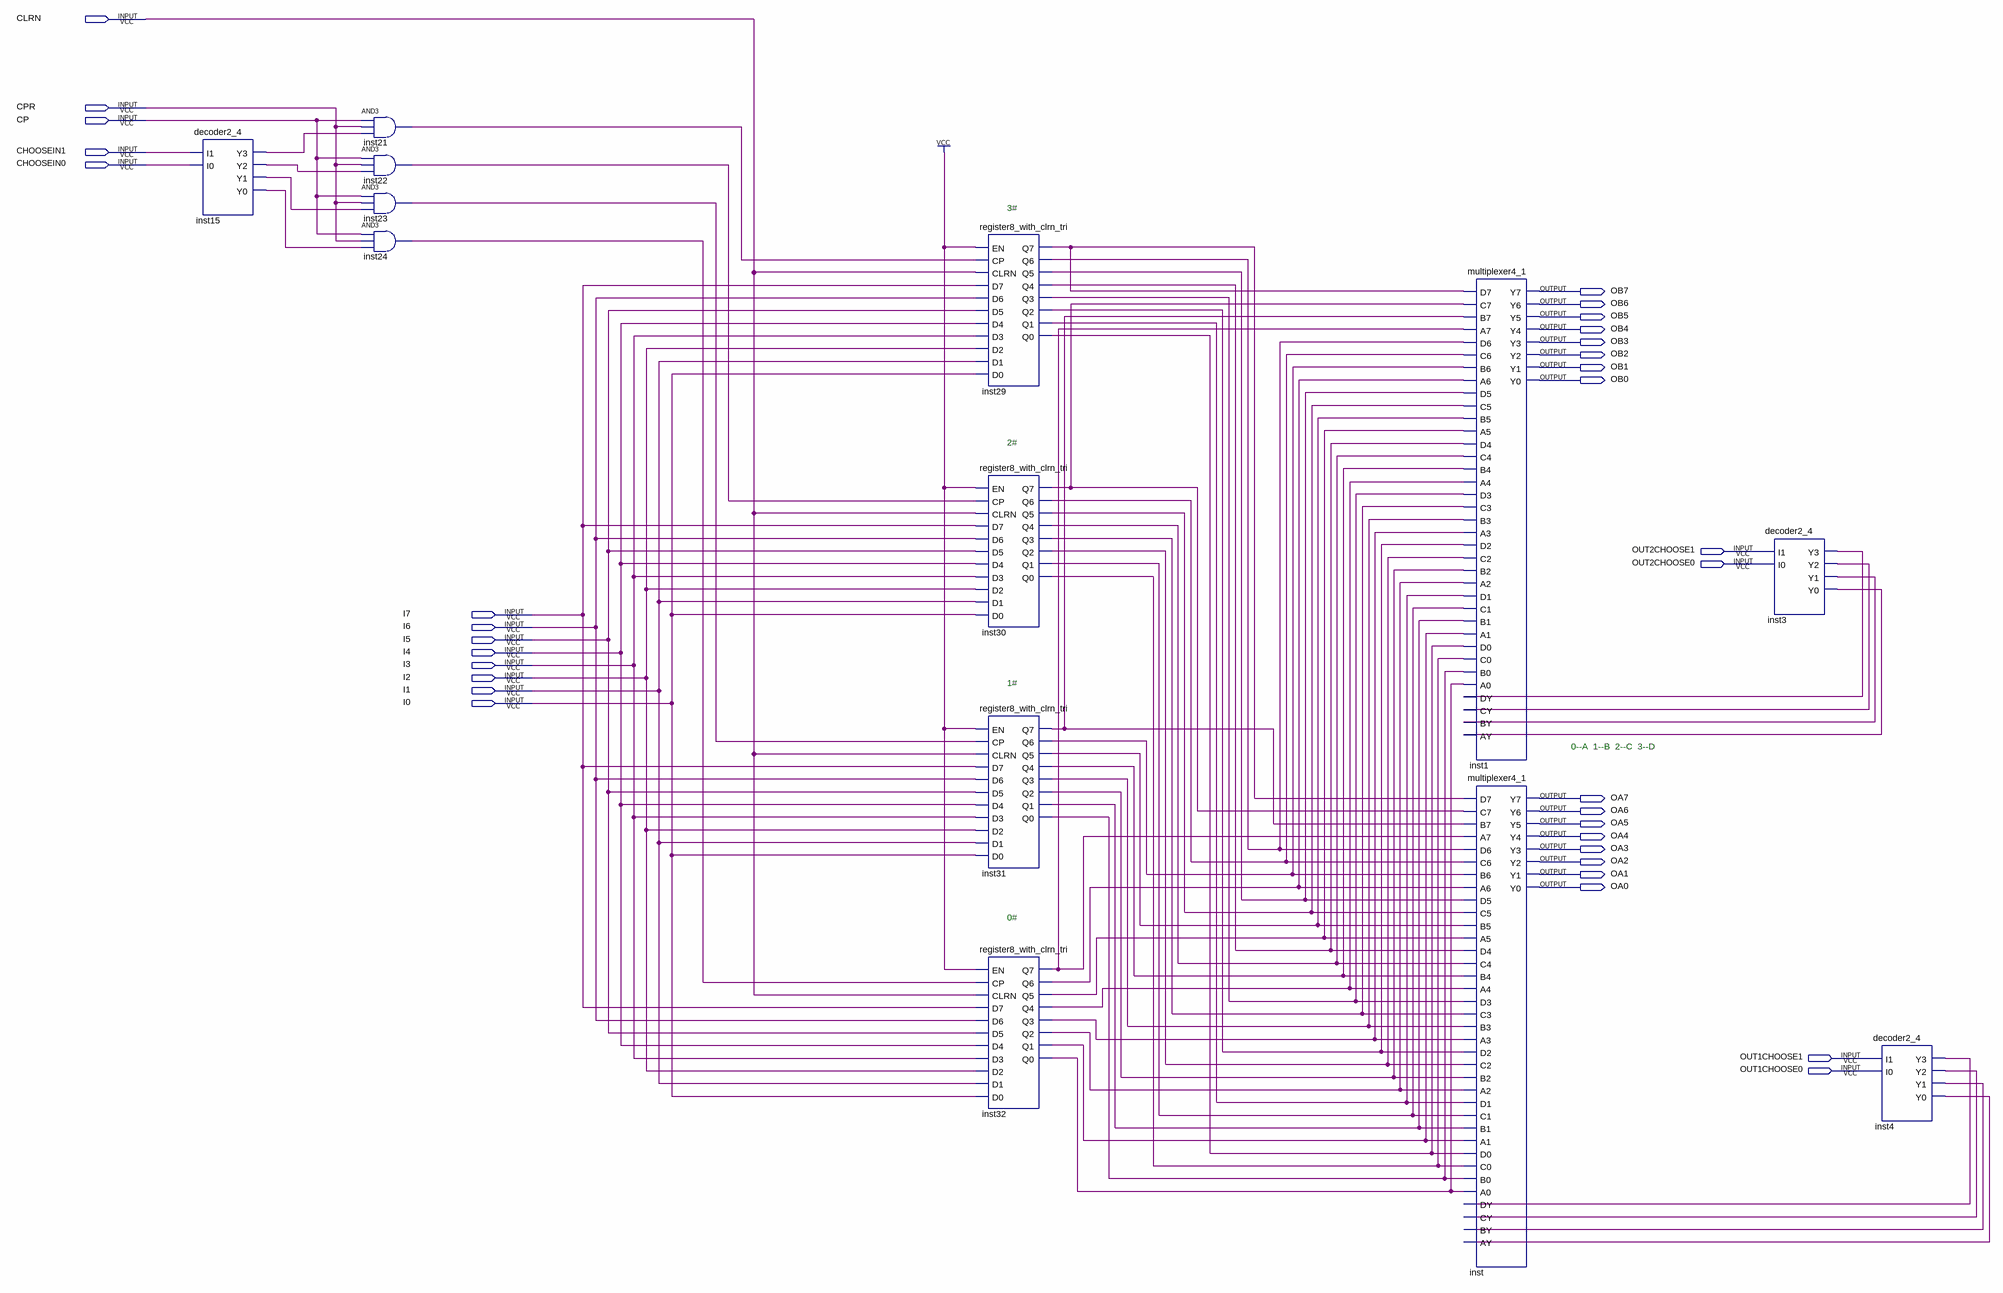
[diagram p0: schematic sheet]
// Quartus schematic register8_group4.bdf as structural Verilog: 13 symbols, 33 pins
module register8_group4 (
  input  CLRN,
  input  CPR,
  input  CP,
  input  CHOOSEIN1,
  input  CHOOSEIN0,
  input  OUT2CHOOSE1,
  input  OUT2CHOOSE0,
  input  I7,
  input  I6,
  input  I5,
  input  I4,
  input  I3,
  input  I2,
  input  I1,
  input  I0,
  input  OUT1CHOOSE1,
  input  OUT1CHOOSE0,
  output OB7,
  output OB6,
  output OB5,
  output OB4,
  output OB3,
  output OB2,
  output OB1,
  output OB0,
  output OA7,
  output OA6,
  output OA5,
  output OA4,
  output OA3,
  output OA2,
  output OA1,
  output OA0
);

  wire inst3_y0, inst3_y1, inst3_y2, inst3_y3, inst4_y0, inst4_y1, inst4_y2, inst4_y3, inst15_y0, inst15_y1,
       inst15_y2, inst15_y3, inst21_out, inst22_out, inst23_out, inst24_out, inst29_q0, inst29_q1, inst29_q2,
       inst29_q3, inst29_q4, inst29_q5, inst29_q6, inst29_q7, inst30_q0, inst30_q1, inst30_q2, inst30_q3,
       inst30_q4, inst30_q5, inst30_q6, inst30_q7, inst31_q0, inst31_q1, inst31_q2, inst31_q3, inst31_q4,
       inst31_q5, inst31_q6, inst31_q7, inst32_q0, inst32_q1, inst32_q2, inst32_q3, inst32_q4, inst32_q5,
       inst32_q6, inst32_q7;

  decoder2_4 inst15 (.I1(CHOOSEIN1), .I0(CHOOSEIN0), .Y3(inst15_y3), .Y2(inst15_y2), .Y1(inst15_y1), .Y0(inst15_y0));
  and inst21 (inst21_out, CP, CPR, inst15_y3);
  and inst22 (inst22_out, CP, CPR, inst15_y2);
  and inst23 (inst23_out, CP, CPR, inst15_y1);
  and inst24 (inst24_out, CP, CPR, inst15_y0);
  register8_with_clrn_tri inst29 (
    .EN(1'b1), .CP(inst21_out), .CLRN(CLRN), .D7(I7), .D6(I6), .D5(I5), .D4(I4), .D3(I3), .D2(I2), .D1(I1),
    .D0(I0), .Q7(inst29_q7), .Q6(inst29_q6), .Q5(inst29_q5), .Q4(inst29_q4), .Q3(inst29_q3), .Q2(inst29_q2),
    .Q1(inst29_q1), .Q0(inst29_q0));
  register8_with_clrn_tri inst30 (
    .EN(1'b1), .CP(inst22_out), .CLRN(CLRN), .D7(I7), .D6(I6), .D5(I5), .D4(I4), .D3(I3), .D2(I2), .D1(I1),
    .D0(I0), .Q7(inst30_q7), .Q6(inst30_q6), .Q5(inst30_q5), .Q4(inst30_q4), .Q3(inst30_q3), .Q2(inst30_q2),
    .Q1(inst30_q1), .Q0(inst30_q0));
  register8_with_clrn_tri inst31 (
    .EN(1'b1), .CP(inst23_out), .CLRN(CLRN), .D7(I7), .D6(I6), .D5(I5), .D4(I4), .D3(I3), .D2(I2), .D1(I1),
    .D0(I0), .Q7(inst31_q7), .Q6(inst31_q6), .Q5(inst31_q5), .Q4(inst31_q4), .Q3(inst31_q3), .Q2(inst31_q2),
    .Q1(inst31_q1), .Q0(inst31_q0));
  register8_with_clrn_tri inst32 (
    .EN(1'b1), .CP(inst24_out), .CLRN(CLRN), .D7(I7), .D6(I6), .D5(I5), .D4(I4), .D3(I3), .D2(I2), .D1(I1),
    .D0(I0), .Q7(inst32_q7), .Q6(inst32_q6), .Q5(inst32_q5), .Q4(inst32_q4), .Q3(inst32_q3), .Q2(inst32_q2),
    .Q1(inst32_q1), .Q0(inst32_q0));
  multiplexer4_1 inst1 (
    .D7(inst29_q7), .C7(inst30_q7), .B7(inst31_q7), .A7(inst32_q7), .D6(inst29_q6), .C6(inst30_q6),
    .B6(inst31_q6), .A6(inst32_q6), .D5(inst29_q5), .C5(inst30_q5), .B5(inst31_q5), .A5(inst32_q5),
    .D4(inst29_q4), .C4(inst30_q4), .B4(inst31_q4), .A4(inst32_q4), .D3(inst29_q3), .C3(inst30_q3),
    .B3(inst31_q3), .A3(inst32_q3), .D2(inst29_q2), .C2(inst30_q2), .B2(inst31_q2), .A2(inst32_q2),
    .D1(inst29_q1), .C1(inst30_q1), .B1(inst31_q1), .A1(inst32_q1), .D0(inst29_q0), .C0(inst30_q0),
    .B0(inst31_q0), .A0(inst32_q0), .DY(inst3_y3), .CY(inst3_y2), .BY(inst3_y1), .AY(inst3_y0), .Y7(OB7),
    .Y6(OB6), .Y5(OB5), .Y4(OB4), .Y3(OB3), .Y2(OB2), .Y1(OB1), .Y0(OB0));
  multiplexer4_1 inst (
    .D7(inst29_q7), .C7(inst30_q7), .B7(inst31_q7), .A7(inst32_q7), .D6(inst29_q6), .C6(inst30_q6),
    .B6(inst31_q6), .A6(inst32_q6), .D5(inst29_q5), .C5(inst30_q5), .B5(inst31_q5), .A5(inst32_q5),
    .D4(inst29_q4), .C4(inst30_q4), .B4(inst31_q4), .A4(inst32_q4), .D3(inst29_q3), .C3(inst30_q3),
    .B3(inst31_q3), .A3(inst32_q3), .D2(inst29_q2), .C2(inst30_q2), .B2(inst31_q2), .A2(inst32_q2),
    .D1(inst29_q1), .C1(inst30_q1), .B1(inst31_q1), .A1(inst32_q1), .D0(inst29_q0), .C0(inst30_q0),
    .B0(inst31_q0), .A0(inst32_q0), .DY(inst4_y3), .CY(inst4_y2), .BY(inst4_y1), .AY(inst4_y0), .Y7(OA7),
    .Y6(OA6), .Y5(OA5), .Y4(OA4), .Y3(OA3), .Y2(OA2), .Y1(OA1), .Y0(OA0));
  decoder2_4 inst3 (.I1(OUT2CHOOSE1), .I0(OUT2CHOOSE0), .Y3(inst3_y3), .Y2(inst3_y2), .Y1(inst3_y1), .Y0(inst3_y0));
  decoder2_4 inst4 (.I1(OUT1CHOOSE1), .I0(OUT1CHOOSE0), .Y3(inst4_y3), .Y2(inst4_y2), .Y1(inst4_y1), .Y0(inst4_y0));

  // Notes on the sheet:
  //   3#
  //   2#
  //   1#
  //   0--A  1--B  2--C  3--D
  //   0#
endmodule
